# EasyEDA Pro project ProPrj_usb转串口_2025-12-08-14-59-02.epro

# Schematic Schematic1
Board Name: Board1; Create Date: 2025-12-06; Page Name: P1; Project Name: usb转串口; Schematic Name: Schematic1; Update Date: 2025-12-06; Company: 嘉立创EDA; Page Size: A4; Version: V1.0
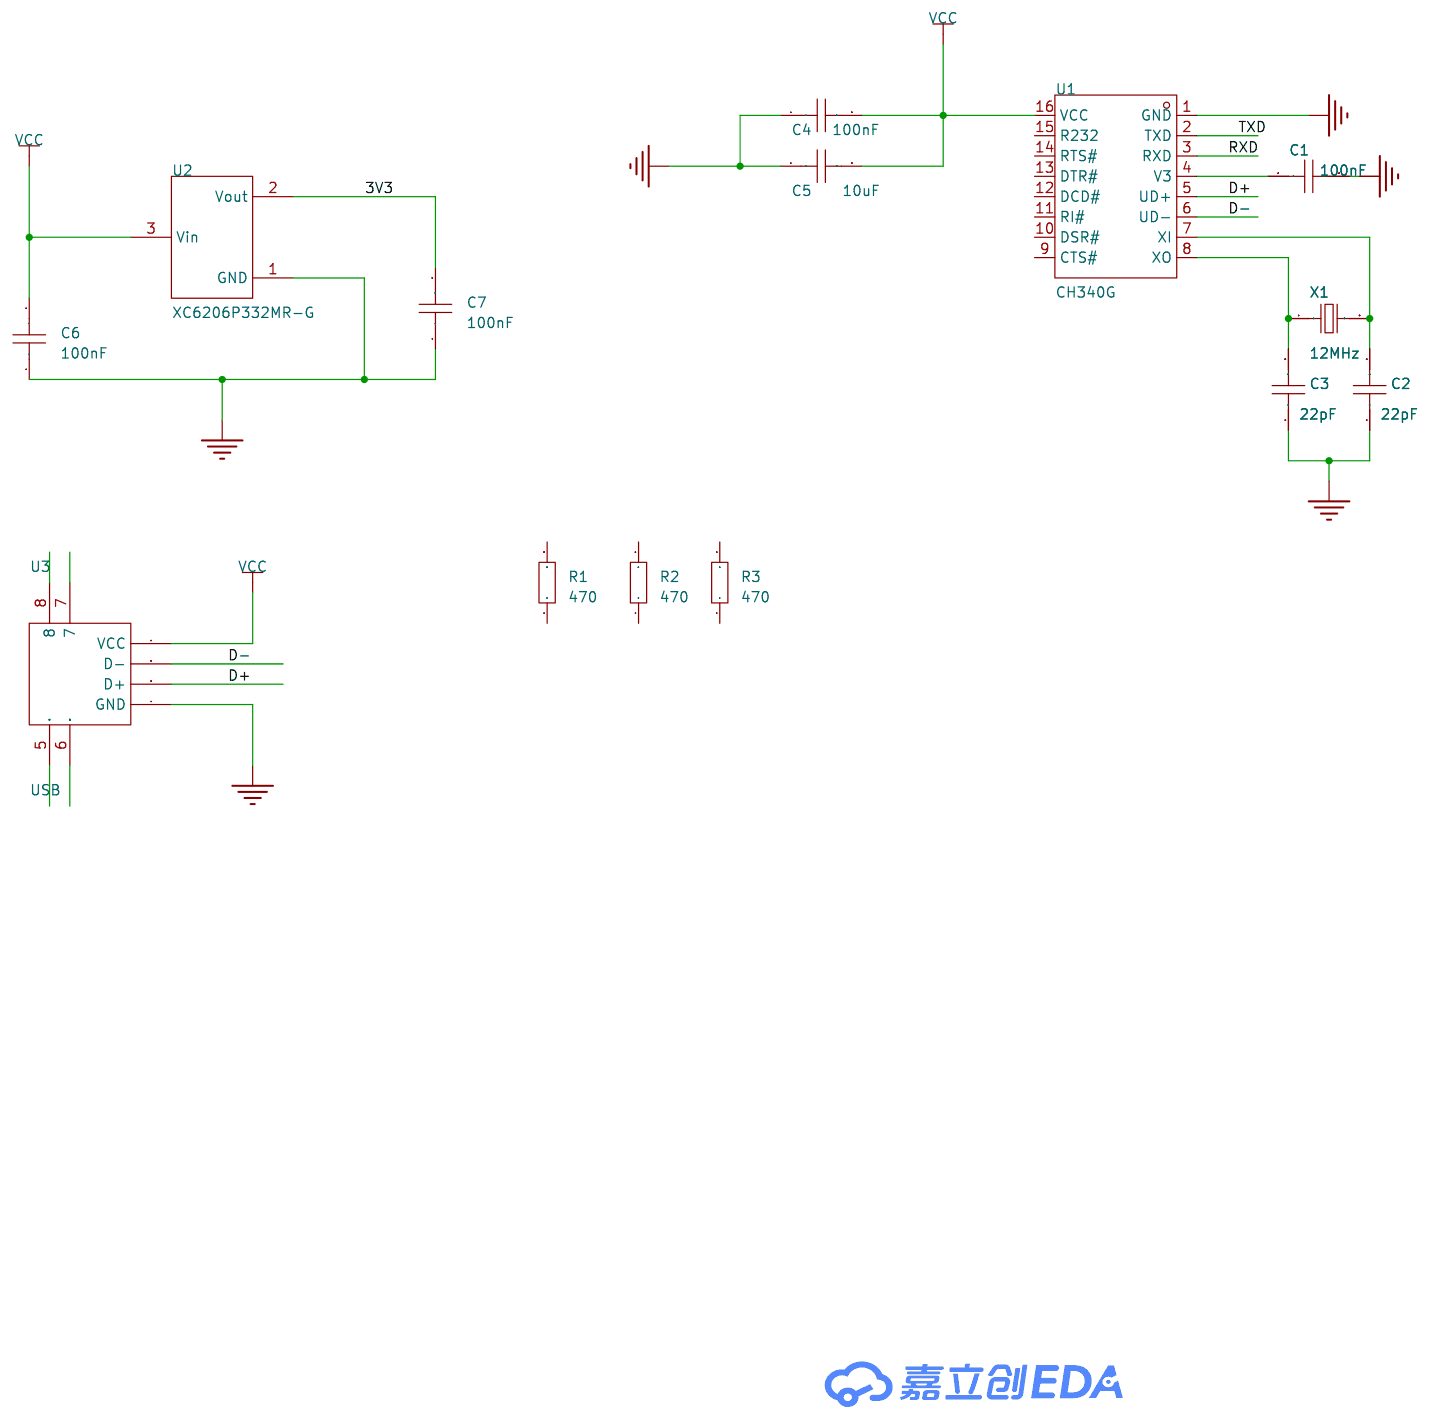
[diagram p0: schematic sheet]

## Parts
C1  100nF  [C0603]
C2  22pF  [C0603]
C3  22pF  [C0603]
C4  100nF  [C0603]
C5  10uF  [C0603]
C6  100nF  [C0603]
C7  100nF  [C0603]
R1  470  [R0603]
R2  470  [R0603]
R3  470  [R0603]
U1  CH340G  [SOIC-16_L9.9-W3.9-P1.27-LS6.0-BL]
U2  XC6206P332MR-G  [SOT-23-3_L2.9-W1.6-P1.90-LS2.8-BR]
U3  USB  [USB-SMD_USB_1]
X1  12MHz  [CRYSTAL-SMD_L5.0-W3.2]

## Library data of the parts
C1-C7 = CAP_0603: Supplier Footprint: 0603
R1-R3 = Res_0603: Supplier Footprint: 0603
U1 = CH340G: 应用功能:USB转UART;接口协议:USB 2.0;数据速率:2Mbps;; LCSC Part Name: USB转串口芯片CH340; Supplier Part: C14267; Manufacturer: WCH(南京沁恒); Supplier Footprint: SOP-16; JLCPCB Part Class: 扩展库; Datasheet: https://atta.szlcsc.com/upload/public/pdf/source/20240313/8510303D24D987FBF1AD30058571F10E.pdf; Supplier: LCSC; Applications Function: USB转UART; Protocol: USB 2.0; Supply Voltage: 5V；3.3V; Data Rate: 2Mbps; Operating Temperature: -40℃~+85℃
U2 = XC6206P332MR-G_C5446: 输出类型:固定;工作电压:6V;输出电压:3.3V;输出电流:200mA;电源纹波抑制比(PSRR):-;输出极性:正极;; LCSC Part Name: 输入6V 输出3.3V 200mA; Supplier Part: C5446; Manufacturer: TOREX(特瑞仕); Supplier Footprint: SOT-23-3L; JLCPCB Part Class: 基础库; Datasheet: https://item.szlcsc.com/datasheet/XC6206P332MR-G/5896.html; Supplier: LCSC; Output Type: 固定; Voltage - Supply: 6V; Output Voltage: 3.3V; Output Current: 200mA; standby current: 1uA; Features: 过流保护; Operating Temperature: -40℃~+85℃@(Ta); Output Configuration: 正极; Number of Outputs: 1
U3 = USB: Supplier Part: C9900237861; Supplier Footprint: SMD; JLCPCB Part Class: 扩展库; Supplier: LCSC
X1 = XC53G2-12.000-F20LJDT: 晶振类型:贴片晶振;频率:12MHz;常温频差:±20ppm;负载电容:20pF;频率稳定度:±30ppm;; LCSC Part Name: 12MHz ±20ppm 20pF; Supplier Part: C2842275; Manufacturer: HCI(杭晶); Supplier Footprint: SMD5032-2P; JLCPCB Part Class: 扩展库; Datasheet: https://item.szlcsc.com/datasheet/XC53G2-12.000-F20LJDT/3026549.html; Supplier: LCSC; Type: 贴片晶振; Normal temperature Frequency Tolerance: ±20ppm; Load Capacitance: 20pF; Frequency Stability: ±30ppm; Equivalent Series Resistance(ESR): 80Ω; Operating Temperature: -40℃~+85℃

## Nets
3V3: C7.2 U2.2(Vout)
GND: C1.2 C2.1 C3.1 C4.1 C5.1 C6.1 C7.1 U1.1(GND) U2.1(GND) U3.4(GND)
VCC: C4.2 C5.2 C6.2 U1.16(VCC) U2.3(Vin) U3.1(VCC)
D+: U1.5(UD+) U3.3(D+)
D-: U1.6(UD-) U3.2(D-)
RXD: U1.3(RXD)
TXD: U1.2(TXD)
Net-(C1-1): C1.1 U1.4(V3)
Net-(C2-2): C2.2 U1.7(XI) X1.2
Net-(C3-2): C3.2 U1.8(XO) X1.1

Not connected (* = marked no-connect by the designer): R1 1 2; R2 1 2; R3 1 2; U1 9(CTS#) 10(DSR#) 11(RI#) 12(DCD#) 13(DTR#) 14(RTS#) 15(R232); U3 5(SH1) 6(SH2) 7 8
